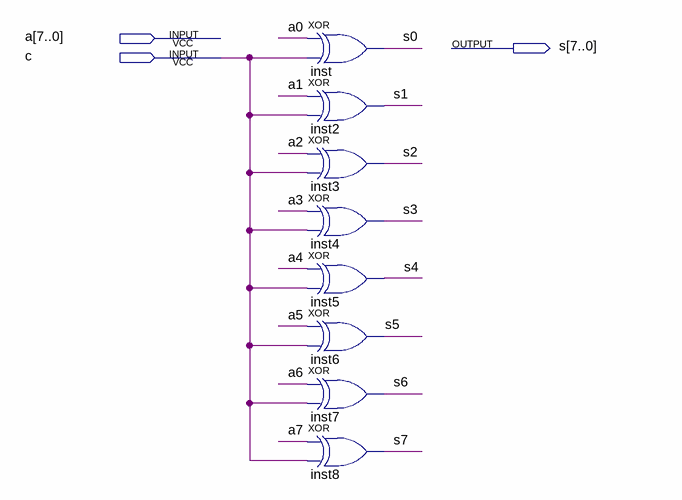
[diagram p0: schematic sheet]
// Quartus schematic xor_vet.bdf as structural Verilog: 8 symbols, 3 pins
module xor_vet (
  input  [7:0] a,
  input  c,
  output [7:0] s
);

  xor inst (s[0], a[0], c);
  xor inst2 (s[1], a[1], c);
  xor inst3 (s[2], a[2], c);
  xor inst4 (s[3], a[3], c);
  xor inst5 (s[4], a[4], c);
  xor inst6 (s[5], a[5], c);
  xor inst7 (s[6], a[6], c);
  xor inst8 (s[7], a[7], c);
endmodule
